# EAGLE design USB-Iso-compact (EAGLE 9.0.1)
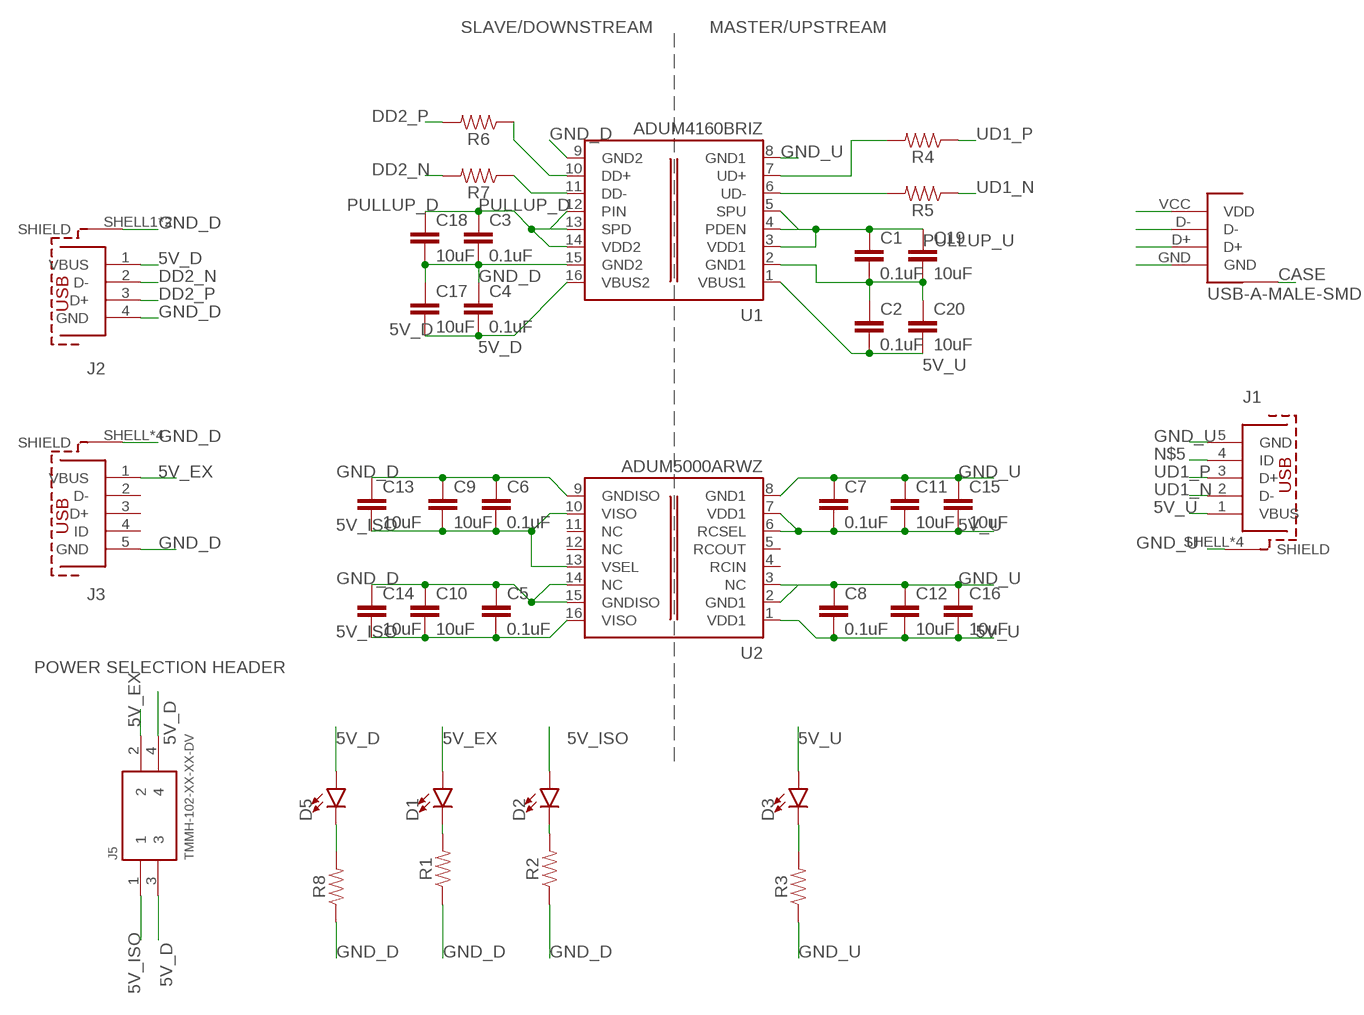
[diagram p0: schematic, sheet 1]

## Parts
C1  0.1uF  0.1UF-0603-100V-10%  [0603]
C2  0.1uF  0.1UF-0603-100V-10%  [0603]
C3  0.1uF  0.1UF-0603-100V-10%  [0603]
C4  0.1uF  0.1UF-0603-100V-10%  [0603]
C5  0.1uF  0.1UF-0603-100V-10%  [0603]
C6  0.1uF  0.1UF-0603-100V-10%  [0603]
C7  0.1uF  0.1UF-0603-100V-10%  [0603]
C8  0.1uF  0.1UF-0603-100V-10%  [0603]
C9  10uF  10UF-0603-6.3V-20%  [0603]
C10  10uF  10UF-0603-6.3V-20%  [0603]
C11  10uF  10UF-0603-6.3V-20%  [0603]
C12  10uF  10UF-0603-6.3V-20%  [0603]
C13  10uF  10UF-0603-6.3V-20%  [0603]
C14  10uF  10UF-0603-6.3V-20%  [0603]
C15  10uF  10UF-0603-6.3V-20%  [0603]
C16  10uF  10UF-0603-6.3V-20%  [0603]
C17  10uF  10UF-0603-6.3V-20%  [0603]
C18  10uF  10UF-0603-6.3V-20%  [0603]
C19  10uF  10UF-0603-6.3V-20%  [0603]
C20  10uF  10UF-0603-6.3V-20%  [0603]
D1  LED0603  [LED-0603]
D2  LED0603  [LED-0603]
D3  LED0603  [LED-0603]
D5  LED0603  [LED-0603]
J1  MICRO-USB-SOCKET  [629105136821]
J2  USB-A-FEMALE-SMD  [629104151021]
J3  MICRO-USB-SOCKET  [629105136821]
J4  USB-A-MALE-SMD  [USB-A-MALE-SMD]
J5  TMMH-102-XX-XX-DV  [TMMH-102-XX-XX-DV]
R1  RESISTOR0603  [0603]
R2  RESISTOR0603  [0603]
R3  RESISTOR0603  [0603]
R4  RESISTOR0603  [0603]
R5  RESISTOR0603  [0603]
R6  RESISTOR0603  [0603]
R7  RESISTOR0603  [0603]
R8  RESISTOR0603  [0603]
U1  ADUM4160BRIZ  [SO-16W]
U2  ADUM5000ARWZ  [SO-16W]

## Nets
5V_D: C4.2 C17.2 D5.A J2.1(VBUS) J5.3 J5.4 U1.16(VBUS2)
5V_EX: D1.A J3.1(VBUS) J5.2
5V_ISO: C5.2 C6.2 C9.2 C10.2 C13.2 C14.2 D2.A J5.1 U2.10(VISO) U2.13(VSEL) U2.16(VISO)
5V_U [power]: C2.2 C7.2 C8.2 C11.2 C12.2 C15.2 C16.2 C20.2 D3.A J1.1(VBUS) J4.VCC(VDD) U1.1(VBUS1) U2.1(VDD1) U2.6(RCSEL) U2.7(VDD1)
DD1_N [USB diff pairs]: R7.1 U1.11(DD-)
DD1_P [USB diff pairs]: R6.1 U1.10(DD+)
DD2_N [USB diff pairs]: J2.2(D-) R7.2
DD2_P [USB diff pairs]: J2.3(D+) R6.2
GND_D: C3.2 C4.1 C5.1 C6.1 C9.1 C10.1 C13.1 C14.1 C17.1 C18.2 J2.4(GND) J2.SHELL1(SHIELD) J2.SHELL2(SHIELD) J3.5(GND) J3.SHELL1(SHIELD) J3.SHELL2(SHIELD) J3.SHELL3(SHIELD) J3.SHELL(SHIELD) R1.1 R2.1 R8.1 U1.9(GND2) U1.15(GND2) U2.9(GNDISO) U2.14(NC) U2.15(GNDISO)
GND_U [power]: C1.2 C2.1 C7.1 C8.1 C11.1 C12.1 C15.1 C16.1 C19.2 C20.1 J1.5(GND) J1.SHELL1(SHIELD) J1.SHELL2(SHIELD) J1.SHELL3(SHIELD) J1.SHELL(SHIELD) J4.CASE1(CASE) J4.CASE2(CASE) J4.GND R3.1 U1.2(GND1) U1.8(GND1) U2.2(GND1) U2.3(NC) U2.8(GND1)
N$1: D5.C R8.2
N$3: D1.C R1.2
N$4: D2.C R2.2
N$5: J1.4(ID)
N$12: D3.C R3.2
PULLUP_D: C3.1 C18.1 U1.12(PIN) U1.13(SPD) U1.14(VDD2)
PULLUP_U: C1.1 C19.1 U1.3(VDD1) U1.4(PDEN) U1.5(SPU)
UD1_N [USB diff pairs]: J1.2(D-) J4.D- R5.1
UD1_P [USB diff pairs]: J1.3(D+) J4.D+ R4.1
UD2_N [USB diff pairs]: R5.2 U1.6(UD-)
UD2_P [USB diff pairs]: R4.2 U1.7(UD+)
Unconnected: J3.2(D-) J3.3(D+) J3.4(ID) U2.4(RCIN) U2.5(RCOUT) U2.11(NC) U2.12(NC)

## Notes on the sheet
- SLAVE/DOWNSTREAM | MASTER/UPSTREAM
- POWER SELECTION HEADER

## Library data of the parts
C1-C8 = SparkFun-Capacitors:0.1UF: 0.1µF ceramic capacitors A capacitor is a passive two-terminal electrical component used to store electrical energy temporarily in an electric field.; PROD_ID: CAP-08390
C9-C20 = SparkFun-Capacitors:10UF: 10.0µF ceramic capacitors A capacitor is a passive two-terminal electrical component used to store electrical energy temporarily in an electric field.; PROD_ID: CAP-11015
D1-D3 D5 = SparkFun-LED:LED: LED (Generic) Standard schematic elements and footprints for 5mm, 3mm, 1206, and 0603 sized LEDs. Generic LEDs with no color specified.
J1 J3 = USB-isolator:MICRO-USB-SOCKET: WR-COM SMT Horizontal 5 Contacts Micro USB Type B,5 pins=>Code : Con_I-O_COM_MicroUSB_629105136821 <http://katalog.we-online.de/media/images/eican/Con_I-O_COM_MicroUSB_629105136821_pf2.jpg> Details see: http://katalog.we-online.de/en/em/COM_MICRO_SMT_TYPE_B_HORIZONTAL/629105136821?m Created 2014-07-09, Karrer Zheng 2014 (C) Würth Elektronik
J2 = USB-isolator:USB-A-FEMALE-SMD: WR-COM_USB_Type A_Horizontal_SMT ; Type A Horizontal SMT - with Pegs - T&R Packaging Code : Con_I-O_COM_USB_2.0_A_629104151021_629104151021 <http://katalog.we-online.de/media/images/eican/Con_I-O_COM_USB_2.0_A_629104151021_pf2.jpg> Details see: http://katalog.we-online.de/em/datasheet/629104151021.pdf Created 12/08/2014, Dan Xu 2014 (C) Wurth Elektronik
J4 = USB-isolator:USB-A-MALE-SMD: Molex 48037-2100 USB-A-MALE-SMD
J5 = USB-isolator:TMMH-102-XX-XX-DV: 2mm (.0787") Flex Shroud, .020" (.51mm) Square Post Terminal Strip, Surface Mount,10 Pins.
R1-R8 = SparkFun-Resistors:RESISTOR: Generic Resistor Package; SPICEPREFIX: R
U1 = USB-isolator:ADUM4160BRIZ: Triple-Channel Digital Isolators Source: http://www.analog.com/static/imported-files/data_sheets/ADuM1300_1301.pdf; MPN: ADUM4160BRIZ
U2 = USB-isolator:ADUM5000ARWZ

## Net classes
0 default: clearance 0.205 mm
1 USB diff pairs: width 0.152 mm, clearance 0.203 mm to class 0, clearance 0.203 mm
2 power: width 0.406 mm, clearance 0.205 mm to class 0, clearance 0.205 mm to class 1, clearance 0.205 mm

## Board
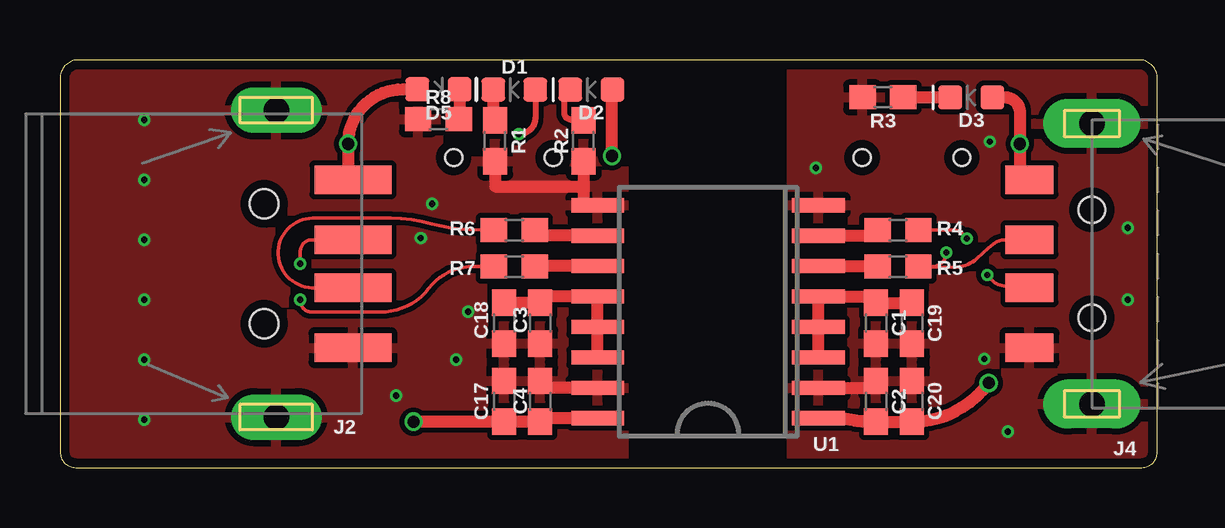
[diagram p1: board, top side]
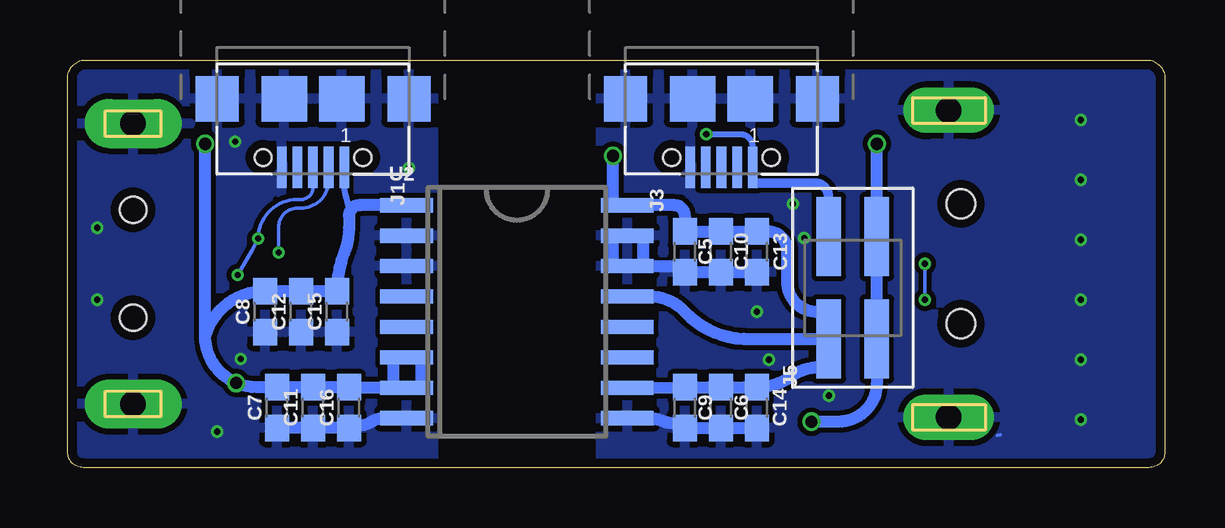
[diagram p2: board, bottom side, seen from below]

Size 45.75 x 17 mm. Coordinates in mm from the lower left corner, seen from the top.
Outline: 0.65,0 45.1,0 arc90 45.73,0.64 45.73,16.07 arc90 45.1,17 0.65,17 arc90 0.01,16.07 0.01,0.64 arc90 0.65,0
Copper layers (1*16): Top 0.035559375mm / dielectric 1.6mm / Bottom 0.035559375mm
Design rules "USB-Iso": minimum track width 6mil, minimum drill 10mil, track to track 0.205mm, track to pad 0.205mm, pad to pad 0.205mm, via to via 0.205mm, smd to smd 6mil, copper to edge 15mil, drill to drill 6mil, minimum pad ring 5mil, minimum via ring 5mil, stop-mask expansion 2.5mil, vias tented up to drill 20mil, thermal gap 10mil

### Footprints (pad centres in the part's own frame; a part is rotated, then mirrored left to right if it is on the bottom)
0603 = smd 1.1 x 1: 1 -0.85,0; 2 0.85,0
LED-0603 = smd 1 x 1: A -0.877,0; C 0.877,0
629105136821 = smd 0.4 x 1.731: 1 -1.3,2.865; 2 -0.65,2.865; 3 0,2.865; 4 0.65,2.865; 5 1.3,2.865 | smd 1.8 x 1.9: SHELL -4,0; SHELL3 4,0 | smd 1.9 x 1.9: SHELL1 -1.2,0; SHELL2 1.2,0 | hole 0.7: -2.075,2.45; 2.075,2.45
629104151021 = smd 1.2 x 3.2: 1 -3.5,3.7; 2 -1,3.7; 3 1,3.7; 4 3.5,3.7 | drill 1.067 pad 1.9 long: SHELL1 6.4,0.5; SHELL2 -6.4,0.5 | hole 1.2: -2.5,0; 2.5,0
USB-A-MALE-SMD = drill 1.067 pad 2.032 long: CASE1 -5.85,0; CASE2 5.85,0 | smd 1.2 x 2: D+ -1,2.6; D- 1,2.6; GND -3.5,2.6; VCC 3.5,2.6 | hole 1.1: -2.25,0; 2.25,0
TMMH-102-XX-XX-DV = smd 1.016 x 3.302: 1 -1,-2.134; 2 -1,2.134; 3 1,-2.134; 4 1,2.134
SO-16W = smd 0.6 x 2.2: 1 -4.445,-4.6; 2 -3.175,-4.6; 3 -1.905,-4.6; 4 -0.635,-4.6; 5 0.635,-4.6; 6 1.905,-4.6; 7 3.175,-4.6; 8 4.445,-4.6; 9 4.445,4.6; 10 3.175,4.6; 11 1.905,4.6; 12 0.635,4.6; 13 -0.635,4.6; 14 -1.905,4.6; 15 -3.175,4.6; 16 -4.445,4.6

### Placement (x,y rotation side)
C1  34.01,6.03 270 top
C2  34.01,2.76 270 top
C3  20.01,6.03 270 top
C4  20.01,2.76 270 top
C5  20.01,9 90 bottom
C6  18.51,2.5 90 bottom
C7  37.01,2.5 90 bottom
C8  37.51,6.5 90 bottom
C9  20.01,2.5 90 bottom
C10  18.51,9 90 bottom
C11  35.51,2.5 90 bottom
C12  36.01,6.5 90 bottom
C13  17.01,9 90 bottom
C14  17.01,2.5 90 bottom
C15  34.51,6.5 90 bottom
C16  34.01,2.5 90 bottom
C17  18.51,2.76 270 top
C18  18.51,6.03 270 top
C19  35.51,6.03 270 top
C20  35.51,2.76 270 top
D1  18.94,15.76 180 top
D2  22.15,15.76 180 top
D3  37.99,15.44 180 top
D5  15.78,15.78 0 top
J1  35.51,15.38 180 bottom
J2  8.51,8.5 270 top
J3  18.49,15.38 180 bottom
J4  43.01,8.5 90 top
J5  13.01,7.5 0 bottom
R1  18.14,13.62 90 top
R2  21.83,13.62 90 top
R3  34.3,15.44 0 top
R4  34.93,9.91 180 top
R5  34.93,8.38 180 top
R6  18.94,9.91 180 top
R7  18.94,8.38 180 top
R8  15.78,14.53 0 top
U1  27.01,6.5 90 top
U2  27.01,6.5 270 bottom

### Tracks (layer width: path | path; a pad name or v marks a point on that pad's centre or on a via)
5V_D  (via drill 0.51)
  Top 0.152: 11.54,11.97 12.01,11.97 12.17,11.97 J2.1
  Top 0.508: U1.16 20.01,2.06 C4.2 C17.2 v14.74,1.91 | 12.01,11.97 v12.01,13.5 arc-90 14.29,15.78 D5.A | v14.74,1.91
  Bottom 0.508: v12.01,13.5 J5.4 J5.3 12.01,3.5 arc90 13.61,1.91 v14.74,1.91
5V_EX  (via drill 0.25)
  Top 0.254: D1.A 19.82,14.59 arc-90 v19.13,13.9
  Bottom 0.2: 17.19,12 J3.1 17.17,12.51 17.27,12.62 17.27,13.24 17.19,13.33 17.19,13.39
  Bottom 0.254: v19.13,13.9 17.7,13.9 arc90 17.19,13.39
  Bottom 0.4: J5.2 14.03,11.28 arc-90 14.58,11.86 17.19,11.88 arc-90 17.19,12
5V_ISO  (via drill 0.51)
  Top 0.508: D2.A v23.01,13
  Bottom 0.152: 19.94,9.83 C5.2 20.03,9.83 | 18.6,9.83 C10.2 | 22.35,3.31 U2.10 22.44,3.4 23.07,3.4
  Bottom 0.508: 20.03,9.83 arc-90 C5.2 20.01,10.5 arc-90 20.46,10.95 U2.16 23.01,10.95 v23.01,13 | C5.2 C10.2 C13.2 16.55,9.85 arc90 15.75,9.05 15.75,7.74 arc-90 14.51,6.5 14.01,6.5 J5.1 | U2.10 C9.2 arc1 C6.2 arc-1 C14.2 arc-35 15.51,3.84 arc47 14.03,4.15 14.01,4.15 J5.1 | U2.13 21.49,7.14 arc47 20.01,6.5 arc-49 17.26,5.36 J5.1
5V_U  (via drill 0.51)
  Top 0.406: 38.88,15.37 D3.A
  Top 0.508: U1.1 32.61,2.04 arc-13 33.1,1.98 arc17 33.5,1.94 arc5 C2.2 C20.2 arc53 v38.71,3.52 | D3.A 39.39,15.44 arc-90 40.01,14.81 v40.01,13.5 40.01,12.4 arc90 J4.VCC
  Bottom 0.152: J1.1 34.21,11.74
  Bottom 0.2: v38.71,3.52 37.86,3.35
  Bottom 0.254: 34.21,11.74 arc-18 34.14,11.26 arc17 34.01,10.5
  Bottom 0.406: 35.49,3.4 C11.2 35.55,3.36 35.66,3.4
  Bottom 0.508: U2.7 32.18,3.33 | 32.18,3.33 34.01,3.33 C16.2 35.55,3.35 35.55,3.36 | U2.1 33.57,10.95 arc-90 34.01,10.5 34.01,10 arc22 34.21,8.96 arc-23 C15.2 C12.2 C8.2 arc-73 40.01,5.5 | C11.2 C7.2 37.86,3.35 arc90 40.01,5.5 | 40.01,5.5 v40.01,13.5 | 31.01,3.5 31.01,4.59 U2.6 32.18,4.59 32.18,3.33
DD1_N
  Top 0.508: U1.11 19.79,8.4 R7.1
DD1_P
  Top 0.508: U1.10 19.79,9.68 R6.1
DD2_N  (via drill 0.25)
  Top 0.152: R7.2 17.26,8.39 arc52 15.36,7.46 arc-53 13.35,6.49 10.49,6.49 arc-90 10.01,6.96 v10.01,7 | v10.01,8.5 10.01,9 arc-90 10.51,9.5 J2.2
  Bottom 0.152: v10.01,7 v10.01,8.5
DD2_P
  Top 0.152: 11.54,7.5 12.17,7.5 J2.3 arc-3 10.51,7.5 arc-179 10.54,10.4 13.78,10.4 arc-17 15.51,10.16 arc15 17.09,9.93 R6.2
GND_D  (via drill 0.25)
  Top 0.152: 22.35,3.4 U1.15 | 20.03,3.57 C4.1
  Top 0.508: U1.15 20.03,3.33 20.03,3.57 | R2.1 21.83,11.72 | 21.83,11.72 21.83,10.95 U1.9 | R1.1 18.14,11.72 21.83,11.72
  Bottom 0.152: 6.98,1.34 6.86,1.36
  Bottom 0.508: U2.9 21.44,2.05 arc23 20.96,1.95 arc-23 20.49,1.85 arc45 C9.1 C6.1 C14.1 | 21.76,9.68 21.76,8.44 | U2.15 23.01,9.68 23.01,8.4 | C13.1 C10.1 C5.1 20.01,8.4 U2.14
  other vias: 15.51,11 16.51,4.5 14.01,3 3.51,2 3.51,4.5 3.51,7 3.51,9.5 3.51,12 3.51,14.5 15.04,9.57 17.01,6.5
  pour Top: 0.01,17 0.01,0 23.51,0 23.51,17
  pour Bottom (rank 6): 0.01,17 0.01,0 23.51,0 23.51,17
  pour Bottom (no thermals): 19.65,12.03 19.65,11.62 arc-90 19.43,11.4 arc237 19.63,10.99 arc-75 20.46,11.45 arc192 20.45,12.15 arc-4
GND_U  (via drill 0.25)
  Top 0.508: U1.2 34.01,3.33 C2.1
  Bottom 0.508: U2.8 32.59,2.05 arc-33 33.09,1.9 arc30 33.51,1.76 | C16.1 C11.1 C7.1
  other vias: 31.51,12.5 38.76,13.6 44.51,10 44.51,7 39.51,1.5 38.53,4.54
  pour Bottom: 45.73,17 45.73,0 30.49,0 30.49,17
  pour Top: 30.49,17 30.49,0 45.73,0 45.73,17
  pour Bottom (no thermals): 36.7,11.96 36.7,11.51 arc-45 37.26,11.28 37.53,11.01 37.53,12 arc90 37.4,12.12 arc-45 37.08,12.26 36.94,12.4 36.84,12.3 arc45
N$1
  Top 0.254: 16.65,14.55 arc-90 R8.2
  Top 0.508: D5.C 16.65,14.55
N$3
  Top 0.254: 18.06,14.55 arc90 R1.2
  Top 0.508: D1.C 18.06,15 18.06,14.55
N$4
  Top 0.254: D2.C 21.01,15.76 21.01,14.81 arc90 21.31,14.51 21.79,14.51 arc-90 R2.2
N$12
  Top 0.508: R3.2 D3.C
PULLUP_D
  Top 0.152: 22.44,4.65 U1.14 | 22.44,5.81 U1.13 | 18.6,6.88 C18.1 | 19.94,6.88 C3.1 20.03,6.88
  Top 0.508: 20.03,6.88 20.03,7.13 U1.12 U1.13 U1.14 | C3.1 C18.1
PULLUP_U
  Top 0.152: 34.06,6.88 C1.1
  Top 0.508: U1.3 U1.4 U1.5 34.06,7.13 34.06,6.88 | C1.1 C19.1
UD1_N  (via drill 0.25)
  Top 0.152: J4.D- 39.4,9.5 arc39 38.91,9.32 arc3 38.21,8.71 arc-39 37.43,8.38 arc-8 R5.1 36.36,8.38 arc90 v36.95,8.97
  Bottom 0.152: J1.2 34.86,11.97 arc90 36.01,10.82 36.16,10.82 arc-90 36.95,10.04 v36.95,8.98 arc90 v36.95,8.97
UD1_P  (via drill 0.25)
  Top 0.152: J4.D+ 39.44,7.56 arc-55 v38.65,8.04 | v37.8,9.55 arc63 37.2,9.91 arc-1 R4.1
  Bottom 0.152: v38.65,8.04 arc-4 v37.8,9.55 v37.8,9.54 arc90 37.8,9.54 arc90 36.16,11.18 36.01,11.18 arc-90 35.51,11.68 J1.3
UD2_N
  Top 0.508: U1.6 33.51,8.4 34.08,8.4 R5.2
UD2_P
  Top 0.508: U1.7 34.08,9.68 R4.2